# Altium schematic sheet leo_BMS.SchDoc
size 529 x 469 mm; SheetNumber: 5; SheetTotal: 6
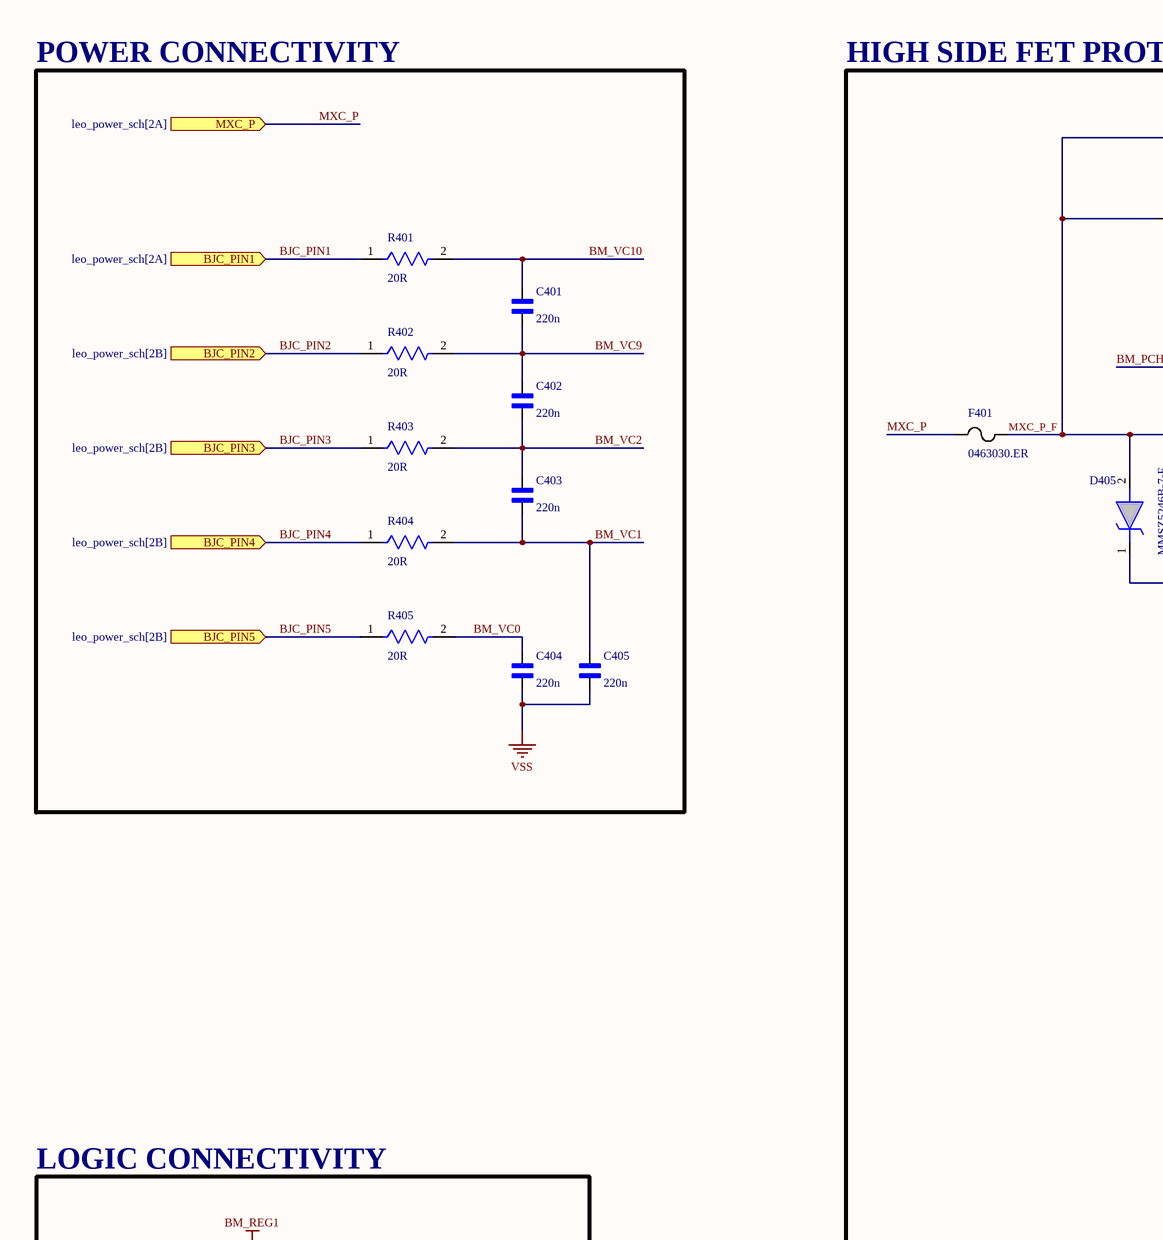
[diagram p0: leo_BMS.SchDoc, top left]
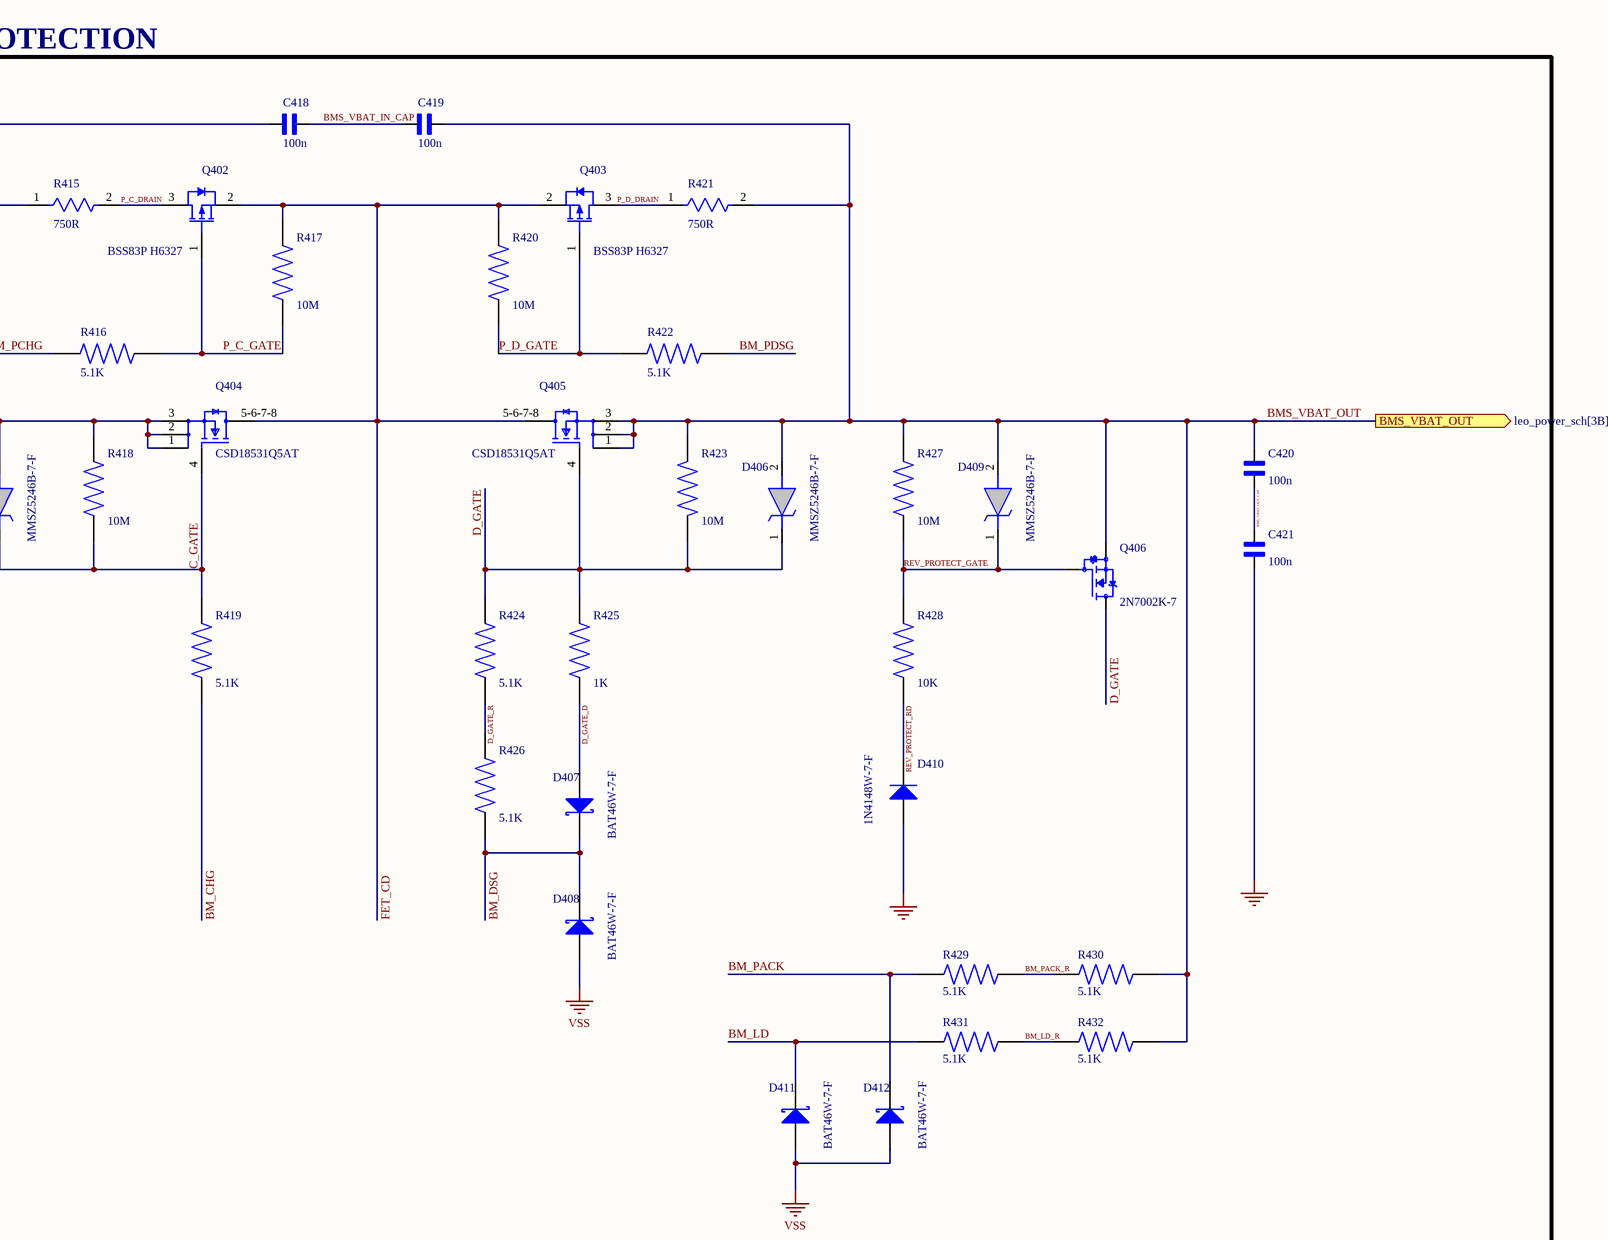
[diagram p1: leo_BMS.SchDoc, top right]
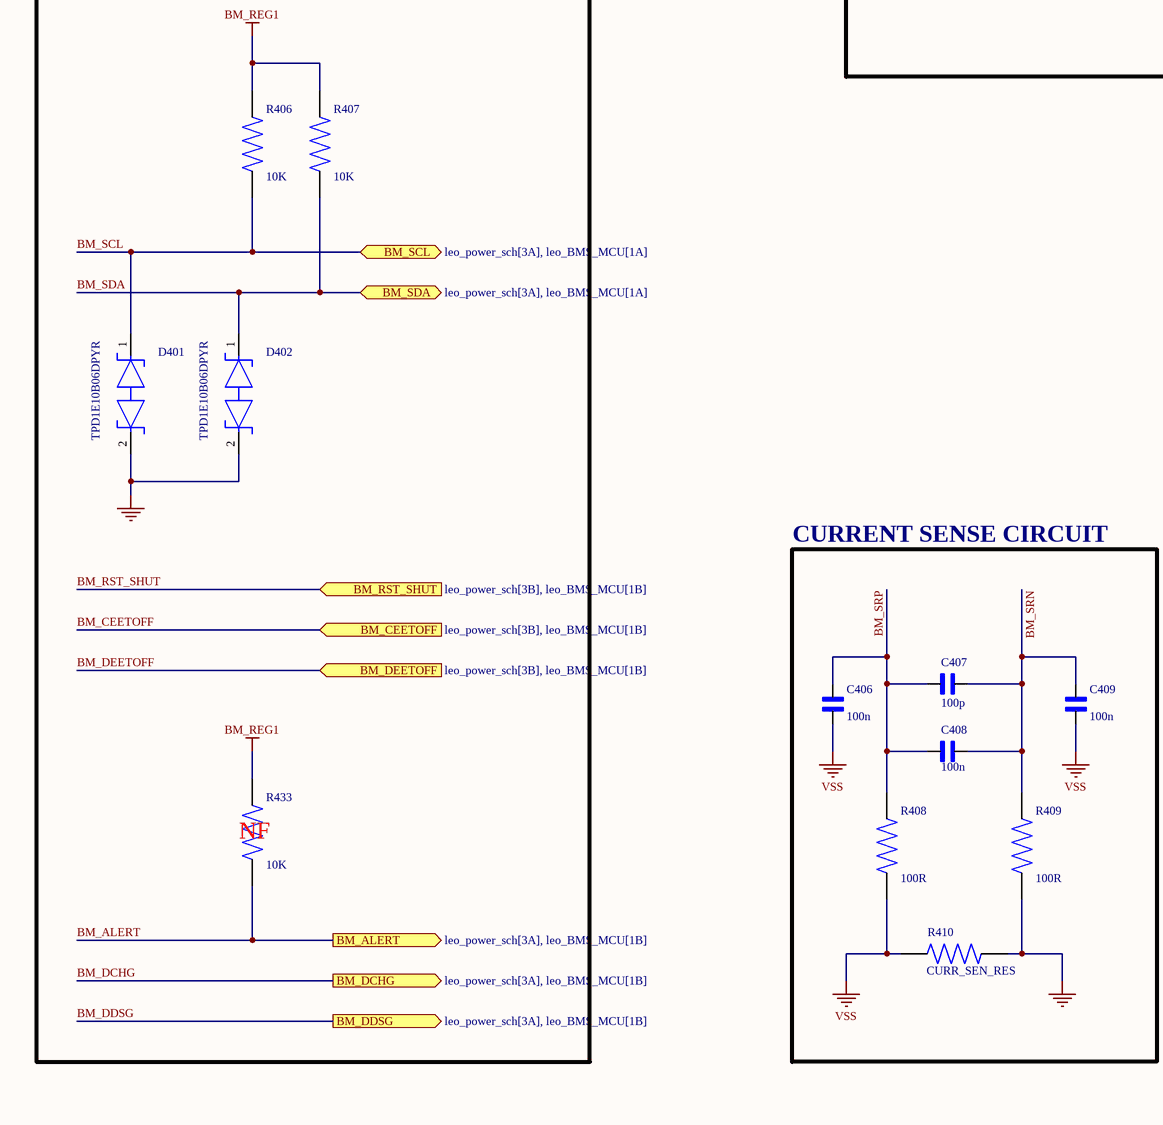
[diagram p2: leo_BMS.SchDoc, bottom left]
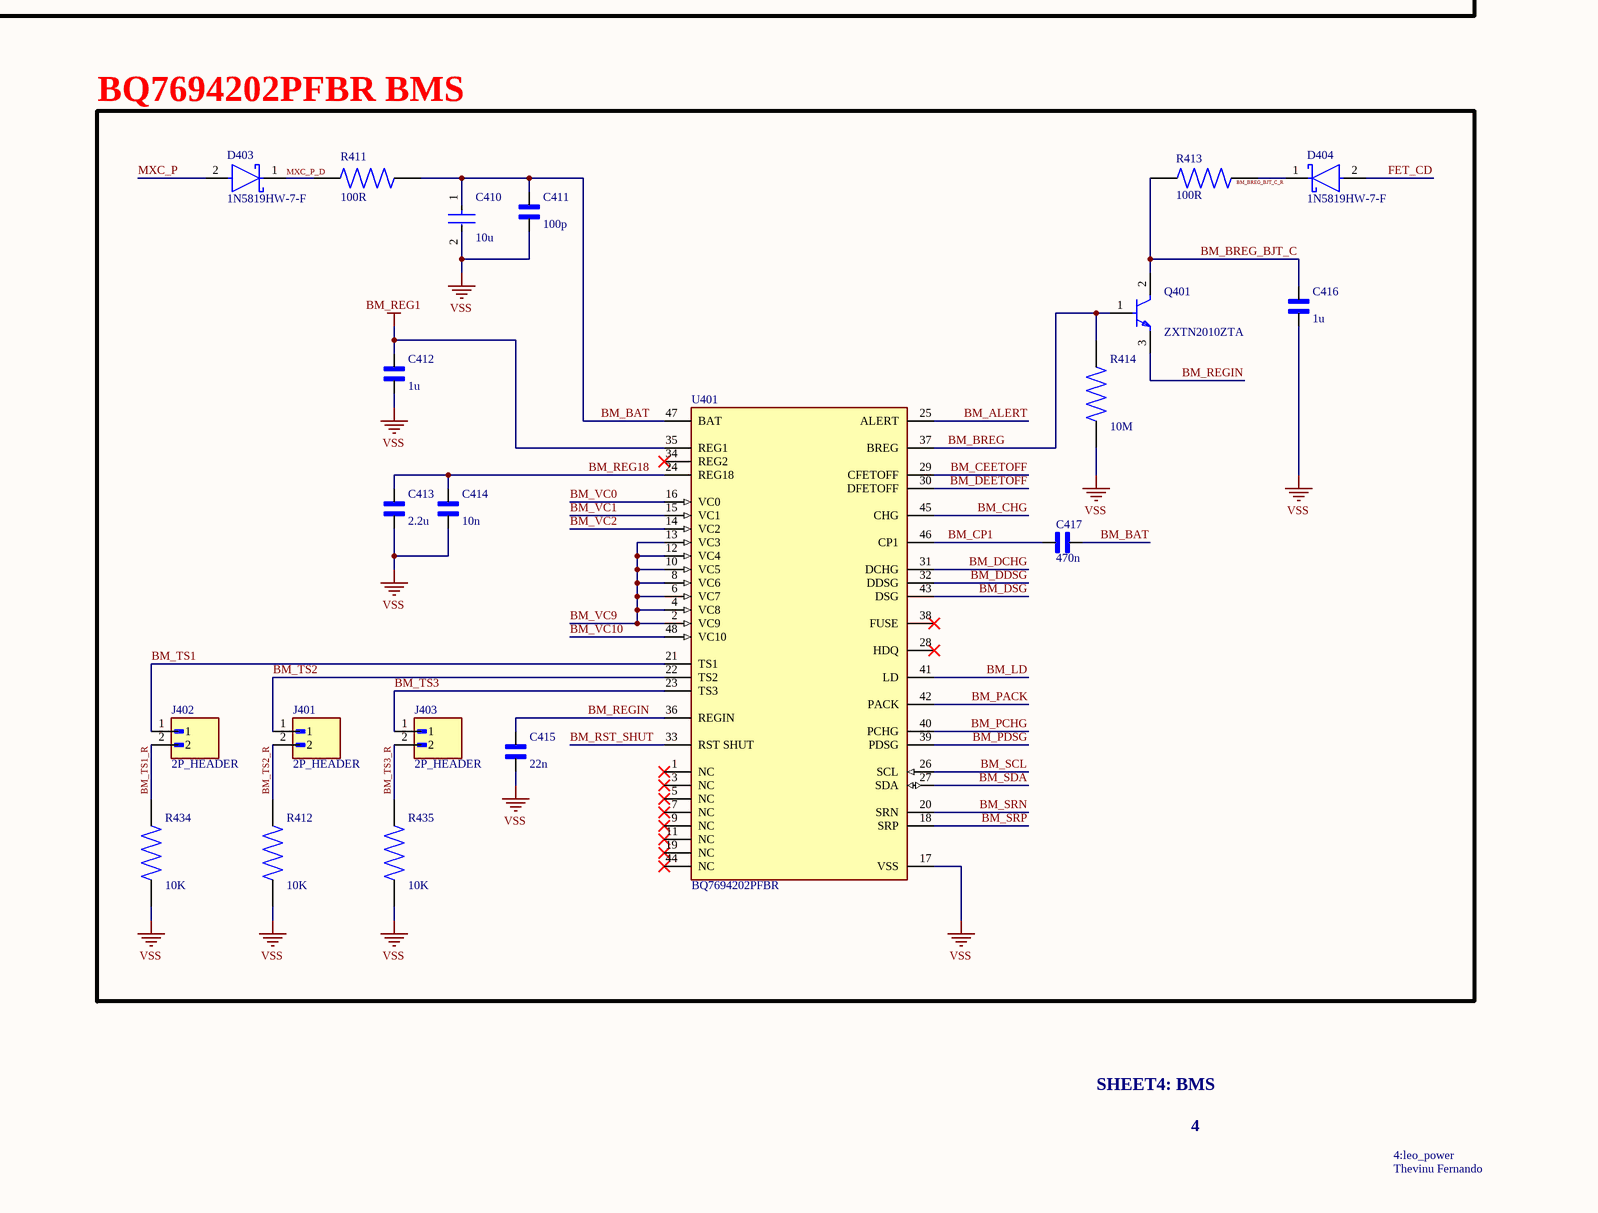
[diagram p3: leo_BMS.SchDoc, bottom right]

## Parts
C401  220n  [CAP_0603]
C402  220n  [CAP_0603]
C403  220n  [CAP_0603]
C404  220n  [CAP_0603]
C405  220n  [CAP_0603]
C406  100n  [CAP_0402]
C407  100p  [CAP_0603]
C408  100n  [CAP_0603]
C409  100n  [CAP_0402]
C410  10u  [CAP_1206]
C411  100p  [CAP_0603]
C412  1u  [CAP_0603]
C413  2.2u  [CAP_0603]
C414  10n  [CAP_0402]
C415  22n  [CAP_0402]
C416  1u  [CAP_0805]
C417  470n  [CAP_0805]
C418  100n  [CAP_0603]
C419  100n  [CAP_0603]
C420  100n  [CAP_0603]
C421  100n  [CAP_0603]
D401  TPD1E10B06DPYR  [FP-DPY0002A-MFG]
D402  TPD1E10B06DPYR  [FP-DPY0002A-MFG]
D403  1N5819HW-7-F  [FP-SOD123-MFG]
D404  1N5819HW-7-F  [FP-SOD123-MFG]
D405  MMSZ5246B-7-F  [SOD123_DIO]
D406  MMSZ5246B-7-F  [SOD123_DIO]
D407  BAT46W-7-F  [DIOD-SOD-123-2_V]
D408  BAT46W-7-F  [DIOD-SOD-123-2_V]
D409  MMSZ5246B-7-F  [SOD123_DIO]
D410  1N4148W-7-F  [DIOD-SOD123-2_V]
D411  BAT46W-7-F  [DIOD-SOD-123-2_V]
D412  BAT46W-7-F  [DIOD-SOD-123-2_V]
F401  0463030.ER  [FUSE_0463_LTF-M]
J401  2P_HEADER  [HARWIN_M20-9990246 2P Header]
J402  2P_HEADER  [HARWIN_M20-9990246 2P Header]
J403  2P_HEADER  [HARWIN_M20-9990246 2P Header]
Q401  ZXTN2010ZTA  [FP-SOT89-MFG]
Q402  BSS83P H6327  [INF-SOT23_N]
Q403  BSS83P H6327  [INF-SOT23_N]
Q404  CSD18531Q5AT  [FP-DQJ0008A-MFG]
Q405  CSD18531Q5AT  [FP-DQJ0008A-MFG]
Q406  2N7002K-7  [SOT91P240X110-3N]
R401  20R  [RES_1210]
R402  20R  [RES_1210]
R403  20R  [RES_1210]
R404  20R  [RES_1210]
R405  20R  [RES_1210]
R406  10K  [RES_0402]
R407  10K  [RES_0402]
R408  100R  [RES_0603]
R409  100R  [RES_0603]
R410  CURR_SEN_RES  [CURR_SEN_RES]
R411  100R  [RES_2512]
R412  10K  [RES_0402]
R413  100R  [RES_2512]
R414  10M  [RES_0402]
R415  750R  [RES_1210]
R416  5.1K  [RES_0603]
R417  10M  [RES_0603]
R418  10M  [RES_0603]
R419  5.1K  [RES_0603]
R420  10M  [RES_0603]
R421  750R  [RES_1210]
R422  5.1K  [RES_0603]
R423  10M  [RES_0603]
R424  5.1K  [RES_0603]
R425  1K  [RES_0603]
R426  5.1K  [RES_0603]
R427  10M  [RES_0603]
R428  10K  [RES_0603]
R429  5.1K  [RES_0603]
R430  5.1K  [RES_0603]
R431  5.1K  [RES_0603]
R432  5.1K  [RES_0603]
R433  10K  [RES_0402]
R434  10K  [RES_0402]
R435  10K  [RES_0402]
U401  BQ7694202PFBR  [FP-PFB0048A-IPC_B]

## Blocks framed on the sheet
POWER CONNECTIVITY: C401-C405 R401-R405
HIGH SIDE FET PROTECTION: C418-C421 D405-D412 F401 Q402-Q406 R415-R432
LOGIC CONNECTIVITY: D401 D402 R406 R407 R433
BQ7694202PFBR BMS: C410-C417 D403 D404 J401-J403 Q401 R411-R414 R434 R435 U401
CURRENT SENSE CIRCUIT: C406-C409 R408-R410

## Ports
BJC_PIN1 (in, see leo_power_sch[2A]), BJC_PIN2 (in, see leo_power_sch[2B]), BJC_PIN3 (in, see leo_power_sch[2B]), BJC_PIN4 (in, see leo_power_sch[2B]), BJC_PIN5 (in, see leo_power_sch[2B]), BM_ALERT (out, see leo_power_sch[3A], leo_BMS_MCU[1B]), BM_CEETOFF (in, see leo_power_sch[3B], leo_BMS_MCU[1B]), BM_DCHG (out, see leo_power_sch[3A], leo_BMS_MCU[1B]), BM_DDSG (out, see leo_power_sch[3A], leo_BMS_MCU[1B]), BM_DEETOFF (in, see leo_power_sch[3B], leo_BMS_MCU[1B]), BM_RST_SHUT (in, see leo_power_sch[3B], leo_BMS_MCU[1B]), BM_SCL (bidir, see leo_power_sch[3A], leo_BMS_MCU[1A]), BM_SDA (bidir, see leo_power_sch[3A], leo_BMS_MCU[1A]), BMS_VBAT_OUT (out, see leo_power_sch[3B], leo_DM_BUCK[1B], leo_RPI_BUCK[1B], leo_SBM_BUCK[1B]), MXC_P (in, see leo_power_sch[2A])

## Nets
BM_REG1: C412.1 R406.2 R407.2 R433.2 U401.35(REG1)
GND: C421.1 D401.2 D402.2 D410.1(A) R409.1 R410.2
VSS: C404.1 C405.1 C406.1 C409.1 C410.2 C411.1 C412.2 C413.1 C414.1 C415.1 C416.2 D408.1(A) D411.1(A) D412.1(A) R408.1 R410.1 R412.1 R414.1 R434.1 R435.1 U401.17(VSS)
BJC_PIN1: R401.1 ; port BJC_PIN1
BJC_PIN2: R402.1 ; port BJC_PIN2
BJC_PIN3: R403.1 ; port BJC_PIN3
BJC_PIN4: R404.1 ; port BJC_PIN4
BJC_PIN5: R405.1 ; port BJC_PIN5
BM_ALERT: R433.1 U401.25(ALERT) ; port BM_ALERT
BM_BAT: C410.1 C411.2 C417.2 R411.2 U401.47(BAT)
BM_BREG: Q401.1(B) R414.2 U401.37(BREG)
BM_BREG_BJT_C: C416.1 Q401.2(C) R413.1
BM_BREG_BJT_C_R: D404.1(C) R413.2
BM_CEETOFF: U401.29(CFETOFF) ; port BM_CEETOFF
BM_CHG: R419.1 U401.45(CHG)
BM_CP1: C417.1 U401.46(CP1)
BM_DCHG: U401.31(DCHG) ; port BM_DCHG
BM_DDSG: U401.32(DDSG) ; port BM_DDSG
BM_DEETOFF: U401.30(DFETOFF) ; port BM_DEETOFF
BM_DSG: D407.2(K) D408.2(K) R426.1 U401.43(DSG)
BM_LD: D411.2(K) R431.2 U401.41(LD)
BM_LD_R: R431.1 R432.2
BM_PACK: D412.2(K) R429.2 U401.42(PACK)
BM_PACK_R: R429.1 R430.2
BM_PCHG: R416.2 U401.40(PCHG)
BM_PDSG: R422.1 U401.39(PDSG)
BM_REG18: C413.2 C414.2 U401.24(REG18)
BM_REGIN: C415.2 Q401.3(E) U401.36(REGIN)
BM_RST_SHUT: U401.33(RST_SHUT) ; port BM_RST_SHUT
BM_SCL: D401.1 R406.1 U401.26(SCL) ; port BM_SCL
BM_SDA: D402.1 R407.1 U401.27(SDA) ; port BM_SDA
BM_SRN: C407.2 C408.2 C409.2 R409.2 U401.20(SRN)
BM_SRP: C406.2 C407.1 C408.1 R408.2 U401.18(SRP)
BM_TS1: J402.1 U401.21(TS1)
BM_TS1_R: J402.2 R434.2
BM_TS2: J401.1 U401.22(TS2)
BM_TS2_R: J401.2 R412.2
BM_TS3: J403.1 U401.23(TS3)
BM_TS3_R: J403.2 R435.2
BM_VC0: C404.2 R405.2 U401.16(VC0)
BM_VC1: C403.1 C405.2 R404.2 U401.15(VC1)
BM_VC2: C402.1 C403.2 R403.2 U401.14(VC2)
BM_VC9: C401.1 C402.2 R402.2 U401.2(VC9) U401.4(VC8) U401.6(VC7) U401.8(VC6) U401.10(VC5) U401.12(VC4) U401.13(VC3)
BM_VC10: C401.2 R401.2 U401.48(VC10)
BMS_VBAT_IN_CAP: C418.2 C419.1
BMS_VBAT_OUT: C419.2 C420.2 D406.2(A) D409.2(A) Q405.1(S) Q405.2(S) Q405.3(S) Q406.2(S) R421.2 R423.2 R427.2 R430.1 R432.1 ; port BMS_VBAT_OUT
BMS_VBAT_OUT_CAP: C420.1 C421.2
C_GATE: D405.1(K) Q404.4(G) R418.1 R419.2
D_GATE: D406.1(K) Q405.4(G) Q406.3(D) R423.1 R424.2 R425.2
D_GATE_D: D407.1(A) R425.1
D_GATE_R: R424.1 R426.2
FET_CD: D404.2(A) Q402.2(SOURCE) Q403.2(SOURCE) Q404.5-6-7-8(D) Q405.5-6-7-8(D) R417.2 R420.2
MXC_P: D403.2(A) F401.1 ; port MXC_P
MXC_P_D: D403.1(C) R411.1
MXC_P_F: C418.1 D405.2(A) F401.2 Q404.1(S) Q404.2(S) Q404.3(S) R415.1 R418.2
P_C_DRAIN: Q402.3(DRAIN) R415.2
P_C_GATE: Q402.1(GATE) R416.1 R417.1
P_D_DRAIN: Q403.3(DRAIN) R421.1
P_D_GATE: Q403.1(GATE) R420.1 R422.2
REV_PROTECT_GATE: D409.1(K) Q406.1(G) R427.1 R428.2
REV_PROTECT_RD: D410.2(K) R428.1

Not connected (* = marked no-connect by the designer): U401 1(NC)* 3(NC)* 5(NC)* 7(NC)* 9(NC)* 11(NC)* 19(NC)* 28(HDQ)* 34(REG2)* 38(FUSE)* 44(NC)*

## Notes on the sheet
- (near R433) NF
- SHEET4: BMS
- 4
- 4:leo_power
- Thevinu Fernando

## Library data of the parts
C401-C405 C407 C408 C411-C413 C418-C421 = CAP_0603: Â±10% 50V Ceramic Capacitor X7R 0603 (1608 Metric); MF: Samsung Electro-Mechanics; MP: CL10B104KB8NNNC; SnapEDA_Link: https://www.snapeda.com/parts/CL10B104KB8NNNC/Samsung/view-part/?ref=snap; Package: SMD-2 Samsung; Value: *; Check_prices: https://www.snapeda.com/parts/CL10B104KB8NNNC/Samsung/view-part/?ref=eda
C406 C409 C414 C415 = CAP_0402: ±10% 50V Ceramic Capacitor X7R 0402; MF: Samsung; MP: CL05B104KO5NNNC; SnapEDA_Link: https://www.snapeda.com/parts/CL05B104KO5NNNC/Samsung/view-part/?ref=snap; Package: SMD-2-2 Samsung; Value: *; Check_prices: https://www.snapeda.com/parts/CL05B104KO5NNNC/Samsung/view-part/?ref=eda
C410 = CAP_1206: Ceramic Capacitor, Multilayer, Ceramic, 25V, 10% +Tol, 10% -Tol, X5R, 15% TC, 22uF, Surface Mount, 1206; Part Number: CL31A226KAHNNNE; Manufacturer: Samsung; Symbol Hash: fb88589c83559698c54462c48d907c3ddae810bd717f4f20b193cecb944ab7ab; Verification Version: 0.0.0.3; Capacitance: 22µF; Mouser Part Number: 187-CL31A226KAHNNNE; Temperature Coefficient: 15%; Temperature Range High: +85°C; Digikey Description: CAP CER 22UF 25V X5R 1206; Digikey Part Number: 1276-3047-1-ND; Tolerance: 10%; ComponentLink2URL: https://product.samsungsem.com/mlcc/CL31A226KAHNNN.do; ComponentLink2Description: Datasheet; Voltage Rating: 25V; Lead Free: Yes; Height: 1.8mm; Temperature Characteristic: X5R; Automotive: No; Package: CL31H-0.2; Temperature Range Low: -55°C; Capacitance: 22uF; RoHS: TRUE; Material: Ceramic; Ipc Land Pattern Name: CAPC320160X160; ComponentLink1Description: Upverter; Supplier 2: Mouser; Supplier 1: Digi-Key; ComponentLink1URL: https://upverter.com/part/id/4e7a76ad8fe2f2e1/; Supplier Part Number 2: 187-CL31A226KAHNNNE; Supplier Part Number 1: 1276-3047-1-ND; Value: 22uF; helpURL: https://upverter.com/part/id/4e7a76ad8fe2f2e1/; Temperature: -55°C to +85°C; RoHS: Compliant; Dielectric: X5R; HelpURL: https://product.samsungsem.com/mlcc/CL31A226KAHNNN.do; Max Operating Temperature: 85°C; Voltage Rating (DC): 25V; ComponentLink2Description: Datasheet URL; Min Operating Temperature: -55°C; Case/Package: 1206
C416 C417 = CAP_0805: Ceramic Capacitor X7R 0805 (2012 Metric); MF: Samsung Electro-Mechanics; MP: CL21B106KOQNNNE; SnapEDA_Link: https://www.snapeda.com/parts/CL21B106KOQNNNE/Samsung+Electro-Mechanics/view-part/?ref=snap; Package: 0805 Samsung; Value: *; Check_prices: https://www.snapeda.com/parts/CL21B106KOQNNNE/Samsung+Electro-Mechanics/view-part/?ref=eda
D401 D402 = TPD1E10B06DPYR: TVS DIODE 5.5V 14V 2X1SON; Leakage Current: 100nA; Min Breakdown Voltage: 6V; Number of Channels: 1; ESD Protection: Yes; Power Line Protection: No; Test Current: 1mA; Interface: GPIO; Element Configuration: Single; Peak Pulse Current: 5A; Direction: Bidirectional; Peak Pulse Power: 90W; Capacitance: 12pF; Composition: Zener; Packaging: Tape and Reel; Number of Pins: 2; Breakdown Voltage: 6V; Radiation Hardening: No; Min Operating Temperature: -40°C; Contact Plating: Gold; Lead Free: Lead Free; Height: 0.35mm; REACH SVHC: No SVHC; Case/Package: 0402; Max Operating Temperature: 125°C; Width: 0.7mm; Clamping Voltage: 14V; Package Quantity: 1; Max Reverse Leakage Current: 100nA; Working Voltage: 5.5V; Length: 1.1mm; Number of Bidirectional Channels: 1; Reverse Standoff Voltage: 5.5V
D403 D404 = 1N5819HW-7-F: DIODE SCHOTTKY 40V 1A SOD123; Forward Voltage: 450mV; Capacitance: 110pF; Max Forward Surge Current (Ifsm): 25A; Peak Reverse Current: 50uA; Polarity: Standard; Element Configuration: Single; Max Power Dissipation: 450mW; Min Operating Temperature: -65°C; Package Quantity: 3000; Contact Plating: Tin; Weight: 0.000353oz; Max Repetitive Reverse Voltage (Vrrm): 40V; Max Reverse Voltage (DC): 40V; Height: 1.25mm; Average Rectified Current: 1A; Width: 1.7mm; Case/Package: SOD-123-2; Lead Free: Lead Free; Max Operating Temperature: 125°C; Current Rating: 1A; Termination: SMD/SMT; Forward Current: 1A; Radiation Hardening: No; Number of Pins: 2; Length: 2.85mm; Voltage Rating (DC): 40V; REACH SVHC: No SVHC; Peak Non-Repetitive Surge Current: 25A; Packaging: Tape and Reel; Output Current: 1A
D405 D406 D409 = MMSZ5246B-7-F: Diodes Inc MMSZ5246B-7-F Zener Diode, 16V 5% 500 mW SMT 2-Pin SOD-123; Manufacturer_Name: Diodes Incorporated; Geometry.Height: 1.45mm; Manufacturer_Part_Number: MMSZ5246B-7-F; Mouser Part Number: 621-MMSZ5246B-F; Mouser Price/Stock: https://www.mouser.co.uk/ProductDetail/Diodes-Incorporated/MMSZ5246B-7-F?qs=YL8BMuhSknSfmeWTDXIh1Q%3D%3D; Arrow Part Number: MMSZ5246B-7-F; Arrow Price/Stock: https://www.arrow.com/en/products/mmsz5246b-7-f/diodes-incorporated?region=europe; Datasheet Link: https://www.diodes.com//assets/Datasheets/ds18010.pdf
D407 D408 D411 D412 = BAT46W-7-F: Surface Mount Schottky Barrier Diode, 100 V, -55 to 125 degC, 2-Pin SOD123, RoHS, Tape and Reel; Manufacturer: Diodes Inc; IR@1.5 V: 0.3 uA Max.; V(BR)R: 100 V Min.; VF@10 mA: 0.45 V Max.; CT@1 V: 12 pF Typ.; PartNumber: BAT46W-7-F; ComponentLink1URL: http://www.diodes.com/; ComponentLink3URL: http://diodes.com/datasheets/ds30044.pdf; PackageDescription: 2-Pin SMD, Body 2.7 x 1.55 mm, Height 1.45 mm; ComponentLink2Description: Datasheet; ComponentLink3Description: Package Specification; Mounting Technology: Surface Mount; ComponentLink1Description: Manufacturer URL; RoHS: TRUE; Operating Temperature: -55 to 125 degC; Packing: Tape and Reel; ComponentLink2URL: http://diodes.com/datasheets/ds30044.pdf; DatasheetVersion: Rev. 16-2
D410 = 1N4148W-7-F: Fast Switching Diode, 100 V, 0.15 A, -65 to 150 degC, 2-Pin?SOD123, RoHS, Tape and Reel; Recovery Time: 4ns; Brand: DiodesIncorporated; Unit Weight: 0.000353oz; Max Surge Current: 2A; Peak Reverse Voltage: 100V; Ir - Reverse Current: 1uA; Vf - Forward Voltage: 1.25V; Configuration: Single; If - Forward Current: 0.15A; Product Category: Diodes-GeneralPurpose,Power,Switching; Operating Temperature Range: -65Cto+150C; Packaging: Reel; Manufacturer URL: http://www.diodes.com/; Maximum Operating Temperature: +150C; Height: 1.25mm; Minimum Operating Temperature: -65C; Product: SwitchingDiodes; Package URL: http://www.diodes.com/datasheets/ds18004.pdf; Type: SwitchingDiode; Package Reference: SOD123-2; Width: 1.7mm; Datasheet URL: http://www.farnell.com/datasheets/1915529.pdf; Datasheet Version: Rev. 24-2, 10/2013; Series: 1N4148; Factory Pack Quantity: 3000; Length: 2.85mm; RoHS: True; Manufacturer: DiodesIncorporated; Mounting Style: SMD/SMT; Package / Case: SOD-123
F401 = 0463030.ER: Littelfuse 30A FF Non-Resettable Surface Mount Fuse, 250V; Manufacturer_Name: Littelfuse Inc; Copyright: Copyright (C) 2025 Ultra Librarian. All rights reserved.; Manufacturer_Part_Number: 0463030.ER
J401-J403 = 2P_HEADER: 2.54mm (0.1) Pitch SIL Vertical Throughboard Pin Header, 6.1mm mating pin height, tin, 2 contacts; MF: Harwin; MP: M20-9990246; SnapEDA_Link: https://www.snapeda.com/parts/M20-9990246/Harwin/view-part/?ref=snap; Package: None; Value: *; Check_prices: https://www.snapeda.com/parts/M20-9990246/Harwin/view-part/?ref=eda
Q401 = ZXTN2010ZTA: TRANS NPN 60V 5A SOT89; Manufacturer: Diodes Inc.; Number Of Elements: 1; Hfe Testic: 10A; Collector Emitter Breakdown Voltage: 80V; Emitter Base Voltage: 7V; Max Junction Temp: +150°C; Unity Gain Freq: 130MHz; Hfe Min: 20; Collector Base Voltage: 150V; Power Dissipation: 1.5W; Rthja Max: 83°C/W; Automotive Grade: Grade 0; Hfe Testvce: 1V; Collector Emitter Saturation Voltage: 170mV; Device Class L1: Discrete Semiconductors; Digikey Description: TRANS NPN 60V 5A SOT89; Automotive: Yes; Mouser Description: Bipolar Transistors - BJT 60V NPN Med Power; Temperature Range Low: -55°C; Number Of Npn: 1; ComponentLink2Description: Datasheet; Temperature: -55°C to +150°C; Package: SOT89; Octopart: https://octopart.com/zxtn2010zta-diodes+inc.-360166; Device Class L3: BJTs; Footprint Url: https://www.diodes.com/assets/Package-Files/SOT89.pdf; Height: 1.6mm; Lead Free: Yes; Manufacturer Part Number: ZXTN2010ZTA; Collector Emitter Voltage: 60V; RoHS: TRUE; ComponentLink2URL: https://www.diodes.com/assets/Datasheets/ZXTN2010Z.pdf; Device Class L2: Transistors; Temperature Range High: +150°C; Max Collector Current: 5A; Category: Trans
Q402 Q403 = BSS83PH6327: SIPMOS(R) Small-Signal-Transistor, -0.33 A, 2 Ohm, -60 V, 3-Pin SOT-23, RoHS, Tape and Reel; Manufacturer: Infineon; Package Version: 04/2016; Mounting Technology: SurfaceMount; Manufacturer URL: http://www.infineon.com/; RoHS: Details; Package Description: 3-Pin Small Outline Transistor Package, Body 2.9 x 1.3 mm, Pitch 0.95 mm; Product Category: MOSFET; Datasheet Version: Rev. 1.5, 03/2012; Package Reference: SOT23; Package URL: http://www.infineon.com/dgdl/Infineon-PG-SOT23-3-5_BSS83PH6327XTSA1-PD-v01_00-EN.pdf?fileId=5546d46254e133b40154f1b7e80354af; Packaging: Reel; Datasheet URL: http://media.digikey.com/pdf/Data%20Sheets/Infineon%20PDFs/BSS83P%20H6327.pdf
Q404 Q405 = CSD18531Q5A: MOSFET N-CH 60V 100A 8VSON; Turn-On Delay Time: 4.4ns; Gate to Source Voltage (Vgs): 20V; Input Capacitance: 3.84nF; Rds On Max: 4.6mR; Element Configuration: Single; Turn-Off Delay Time: 20ns; Fall Time: 2.7ns; Rise Time: 7.8ns; Max Power Dissipation: 3.1W; Resistance: 0.0035R; Continuous Drain Current (ID): 100A; Mount: Surface Mount; Packaging: Tape and Reel; Number of Pins: 8; Contact Plating: Tin; RoHS Compliant: Yes; Min Operating Temperature: -55°C; Max Operating Temperature: 150°C; Drain to Source Voltage (Vdss): 60V; Lead Free: Contains Lead
Q406 = 2N7002K-7: 2N7002K Series 60 V 2 Ohm SMT N-Channel Enhancement Mode Mosfet - SOT-23-3; MF: {'manufacturer': u'Diodes Incorporated'}; Package: None; Price: None; Value: *; MP: 2N7002K-7; Availability: Unavailable
R401-R405 = RES_1210: RES SMD 205K OHM 1% 1/2W 1663; Power Rating: 500mW; Temperature Coefficient: 100ppm/°C; Voltage Rating: 200V; Packaging: Tape and Reel; Case Code (Metric): 3225; Length: 3.2mm; Features: Automotive AEC-Q200; Lead Free: Lead Free; Weight: 0.000564oz; Resistance: 20R; Case/Package: 1210; Max Power Dissipation: 500mW; Composition: Thick Film; Radiation Hardening: No; Depth: 2.5mm; Contact Plating: Tin; Width: 0.098inch; Case Code (Imperial): 1210; Tolerance: 1%; Military Standard: Not; Package Quantity: 1; Mount: Surface Mount; Voltage Rating (DC): 200V; Min Operating Temperature: -55°C; Max Operating Temperature: 155°C; Number of Terminations: 2; Number of Pins: 2; Height: 0.024inch
R406 R407 R412 R414 R433-R435 = RES_0402: Chip Resistor 0402 (1005 Metric) Automotive AEC-Q200 Thick Film; MF: Panasonic; MP: ERJ-2RKF1002X; Package: 1005-2 Panasonic; Price: None; Check_prices: https://www.snapeda.com/parts/ERJ-2RKF1002X/Panasonic%20Electronic%20Components/view-part/78636/?ref=eda; Value: *; SnapEDA_Link: https://www.snapeda.com/parts/ERJ-2RKF1002X/Panasonic%20Electronic%20Components/view-part/78636/?ref=snap; Availability: In Stock
R408 R409 R416-R420 R422-R432 = RES_0603: Â±1% 0.1W, 1/10W Chip Resistor 0603 (1608 Metric) Moisture Resistant Thick Film; MF: Yageo; MP: RC0603FR-0791KL; SnapEDA_Link: https://www.snapeda.com/parts/RC0603FR-0791KL/Yageo/view-part/?ref=snap; Package: 1608 Yageo; Value: *; Check_prices: https://www.snapeda.com/parts/RC0603FR-0791KL/Yageo/view-part/?ref=eda
R410 = CURR_SEN_RES: Resistor, Metal Strip, Res 0.001 Ohms, Pwr-Trg 3 W, Tol 1%, SMD | Bourns CRE2512-FZ-R001E-3; MF: Bourns Inc.; SnapEDA_Link: https://www.snapeda.com/parts/CRE2512-FZ-R001E-3/Bourns/view-part/?ref=snap; Package: 6432 Stackpole; Value: *; MP: CRE2512-FZ-R001E-3; Check_prices: https://www.snapeda.com/parts/CRE2512-FZ-R001E-3/Bourns/view-part/?ref=eda
R411 R413 = RES_2512: Resistor, Thick Film, 100 Ohms, 1 W, 1%, SMT, 2512, TCR 37 ppm/DegC, Cut Tape | Vishay Dale CRCW2512100RFKEG; SnapEDA_Link: https://www.snapeda.com/parts/CRCW2512100RFKEG/Vishay+Dale/view-part/?ref=snap; Package: 6331 Vishay; Value: *; MF: Vishay Dale; MP: CRCW2512100RFKEG; Check_prices: https://www.snapeda.com/parts/CRCW2512100RFKEG/Vishay+Dale/view-part/?ref=eda
R415 R421 = RES_1210: RES SMD 205K OHM 1% 1/2W 1663; Power Rating: 500mW; Resistance: 20R; Temperature Coefficient: 100ppm/°C; Voltage Rating: 200V; Packaging: Tape and Reel; Case Code (Metric): 3225; Length: 3.2mm; Features: Automotive AEC-Q200; Lead Free: Lead Free; Weight: 0.000564oz; Case/Package: 1210; Max Power Dissipation: 500mW; Composition: Thick Film; Radiation Hardening: No; Depth: 2.5mm; Contact Plating: Tin; Width: 0.098inch; Case Code (Imperial): 1210; Tolerance: 1%; Military Standard: Not; Package Quantity: 1; Mount: Surface Mount; Voltage Rating (DC): 200V; Min Operating Temperature: -55°C; Max Operating Temperature: 155°C; Number of Terminations: 2; Number of Pins: 2; Height: 0.024inch
U401 = BQ7694202PFBR: High-precision series battery monitor and protector for 3 to 10 cells of lithium-ion, lithium-polymer, and lithium iron phosphate battery packs